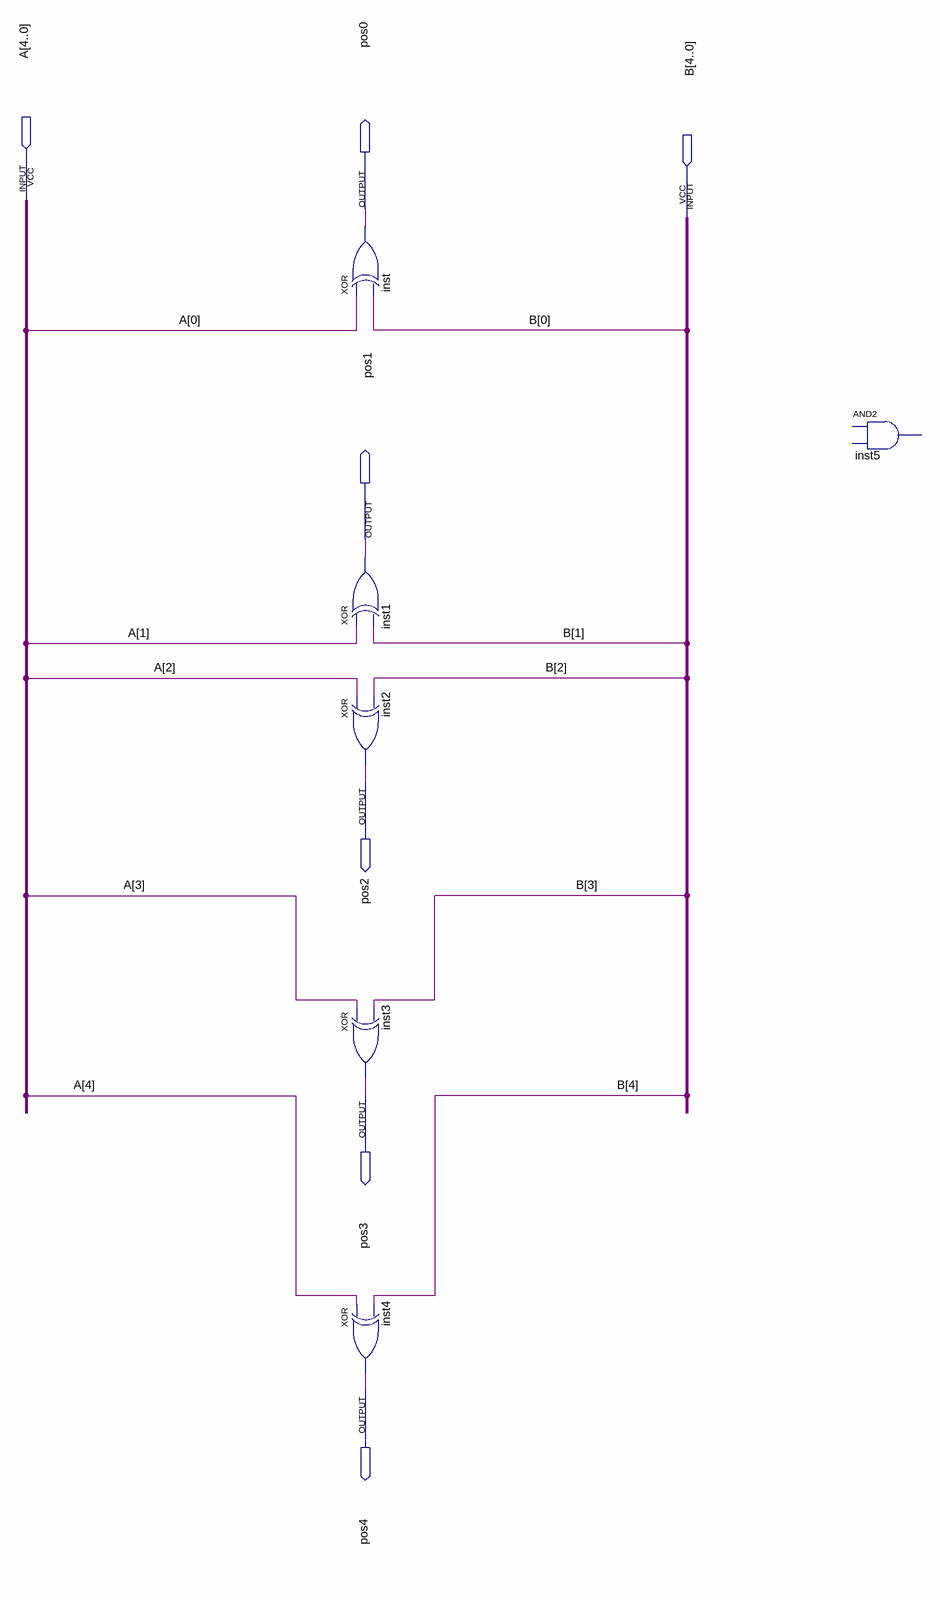
[diagram p0: schematic sheet]
// Quartus schematic xorvetores.bdf as structural Verilog: 6 symbols, 7 pins
module xorvetores (
  input  [4:0] A,
  input  [4:0] B,
  output pos0,
  output pos1,
  output pos2,
  output pos3,
  output pos4
);

  xor inst (pos0, A[0], B[0]);
  xor inst1 (pos1, A[1], B[1]);
  xor inst2 (pos2, A[2], B[2]);
  xor inst3 (pos3, A[3], B[3]);
  xor inst4 (pos4, A[4], B[4]);
  // AND2 inst5 is placed but not wired
endmodule
